# EAGLE schematic Coprocessor_Board_Rev2 (EAGLE 8.6.3)
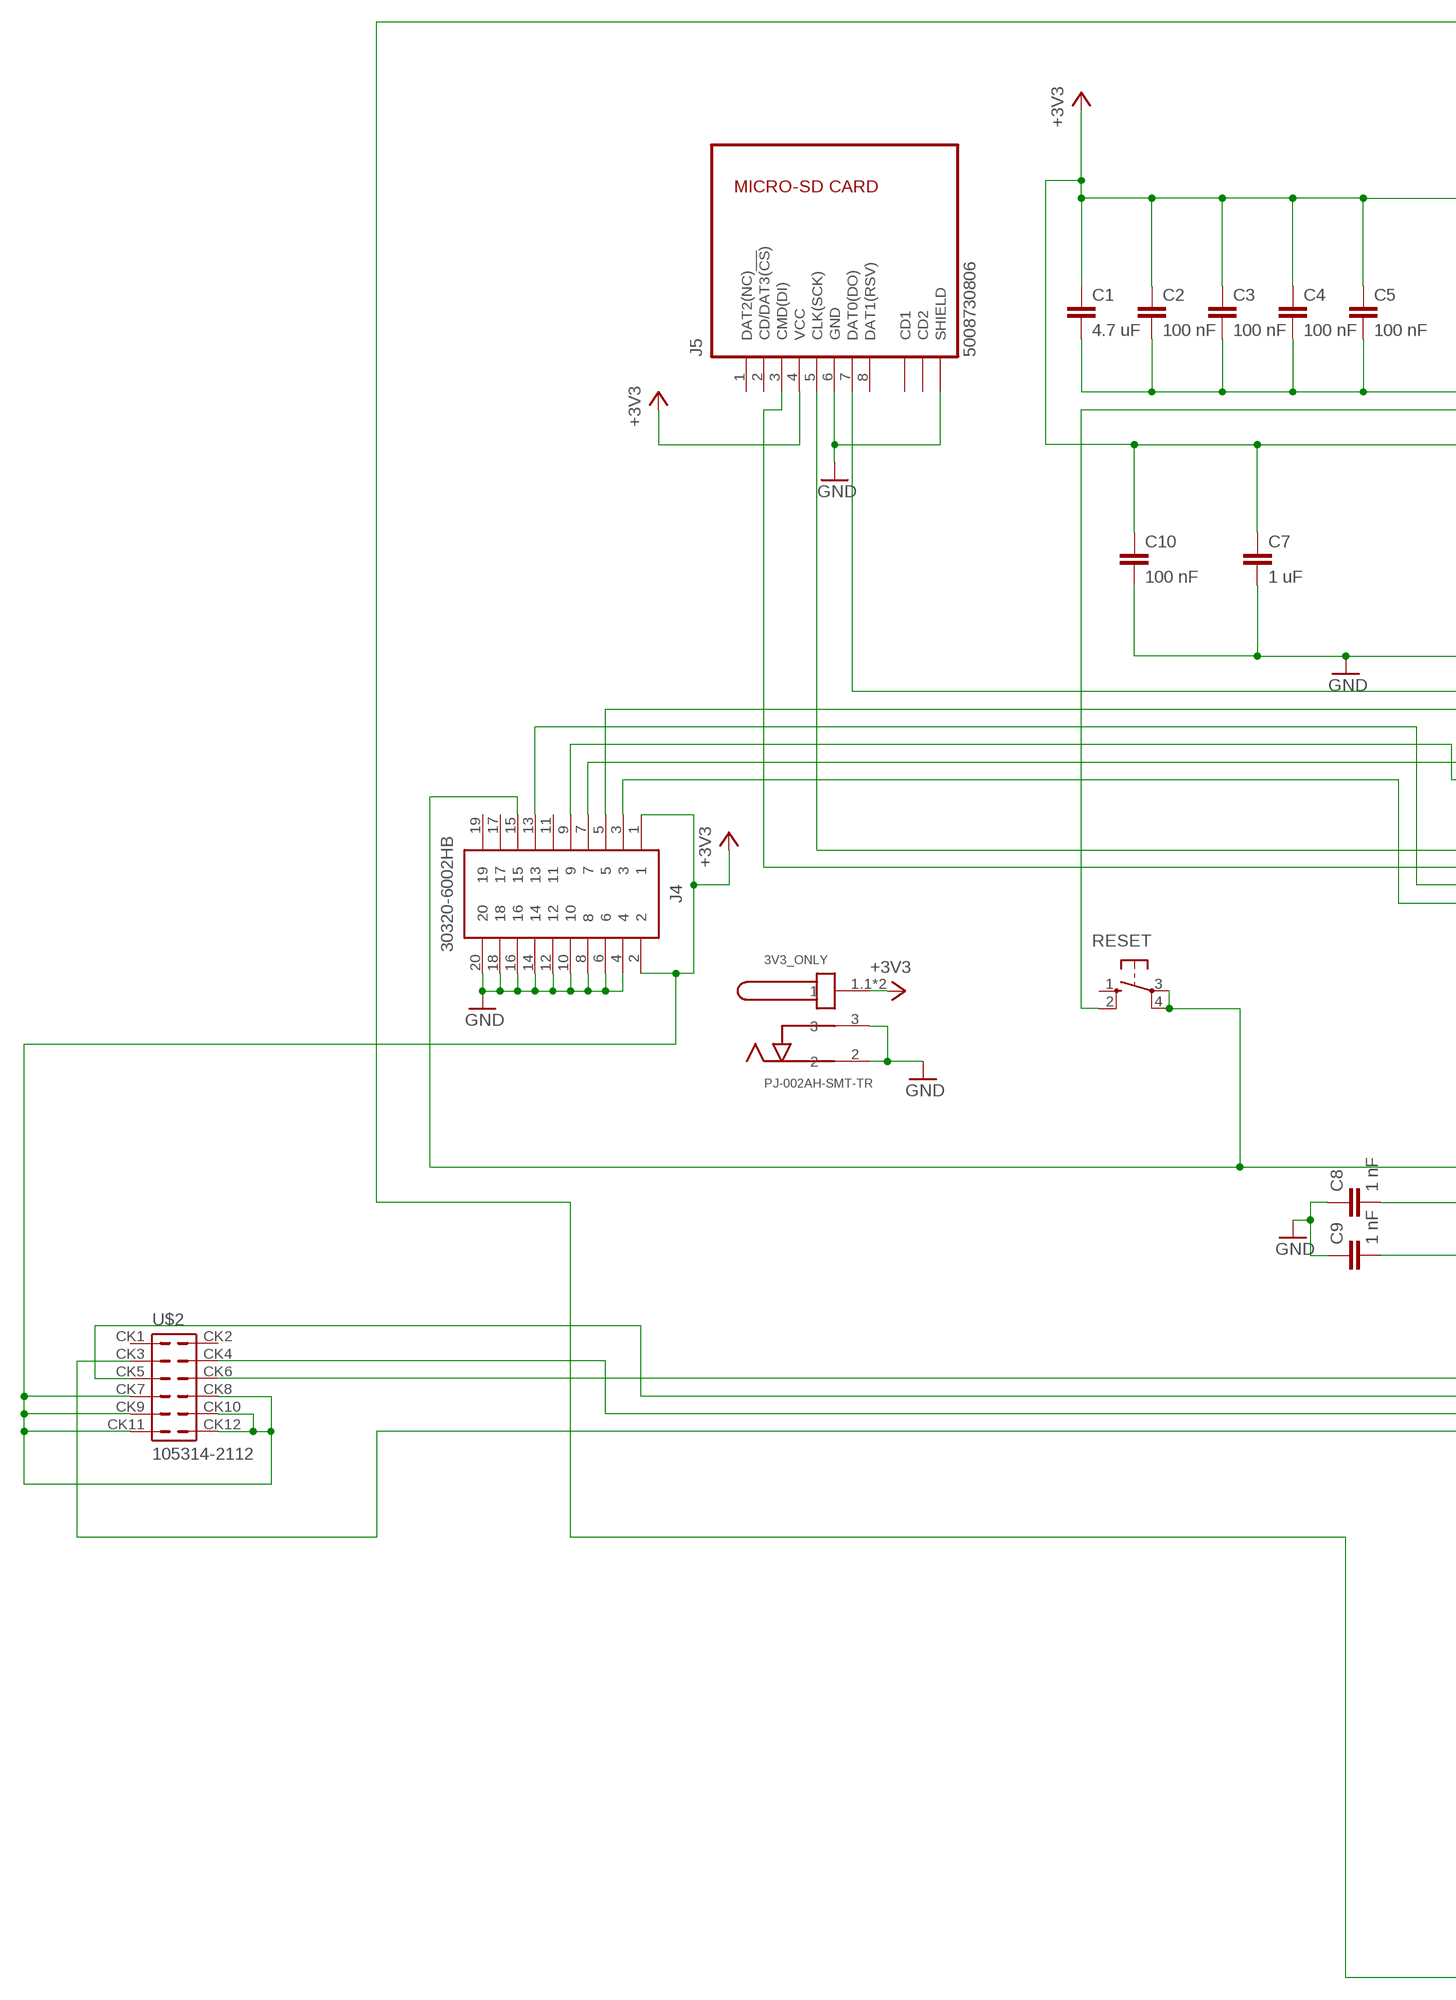
[diagram p0: schematic, sheet 1, part 1 of 2]
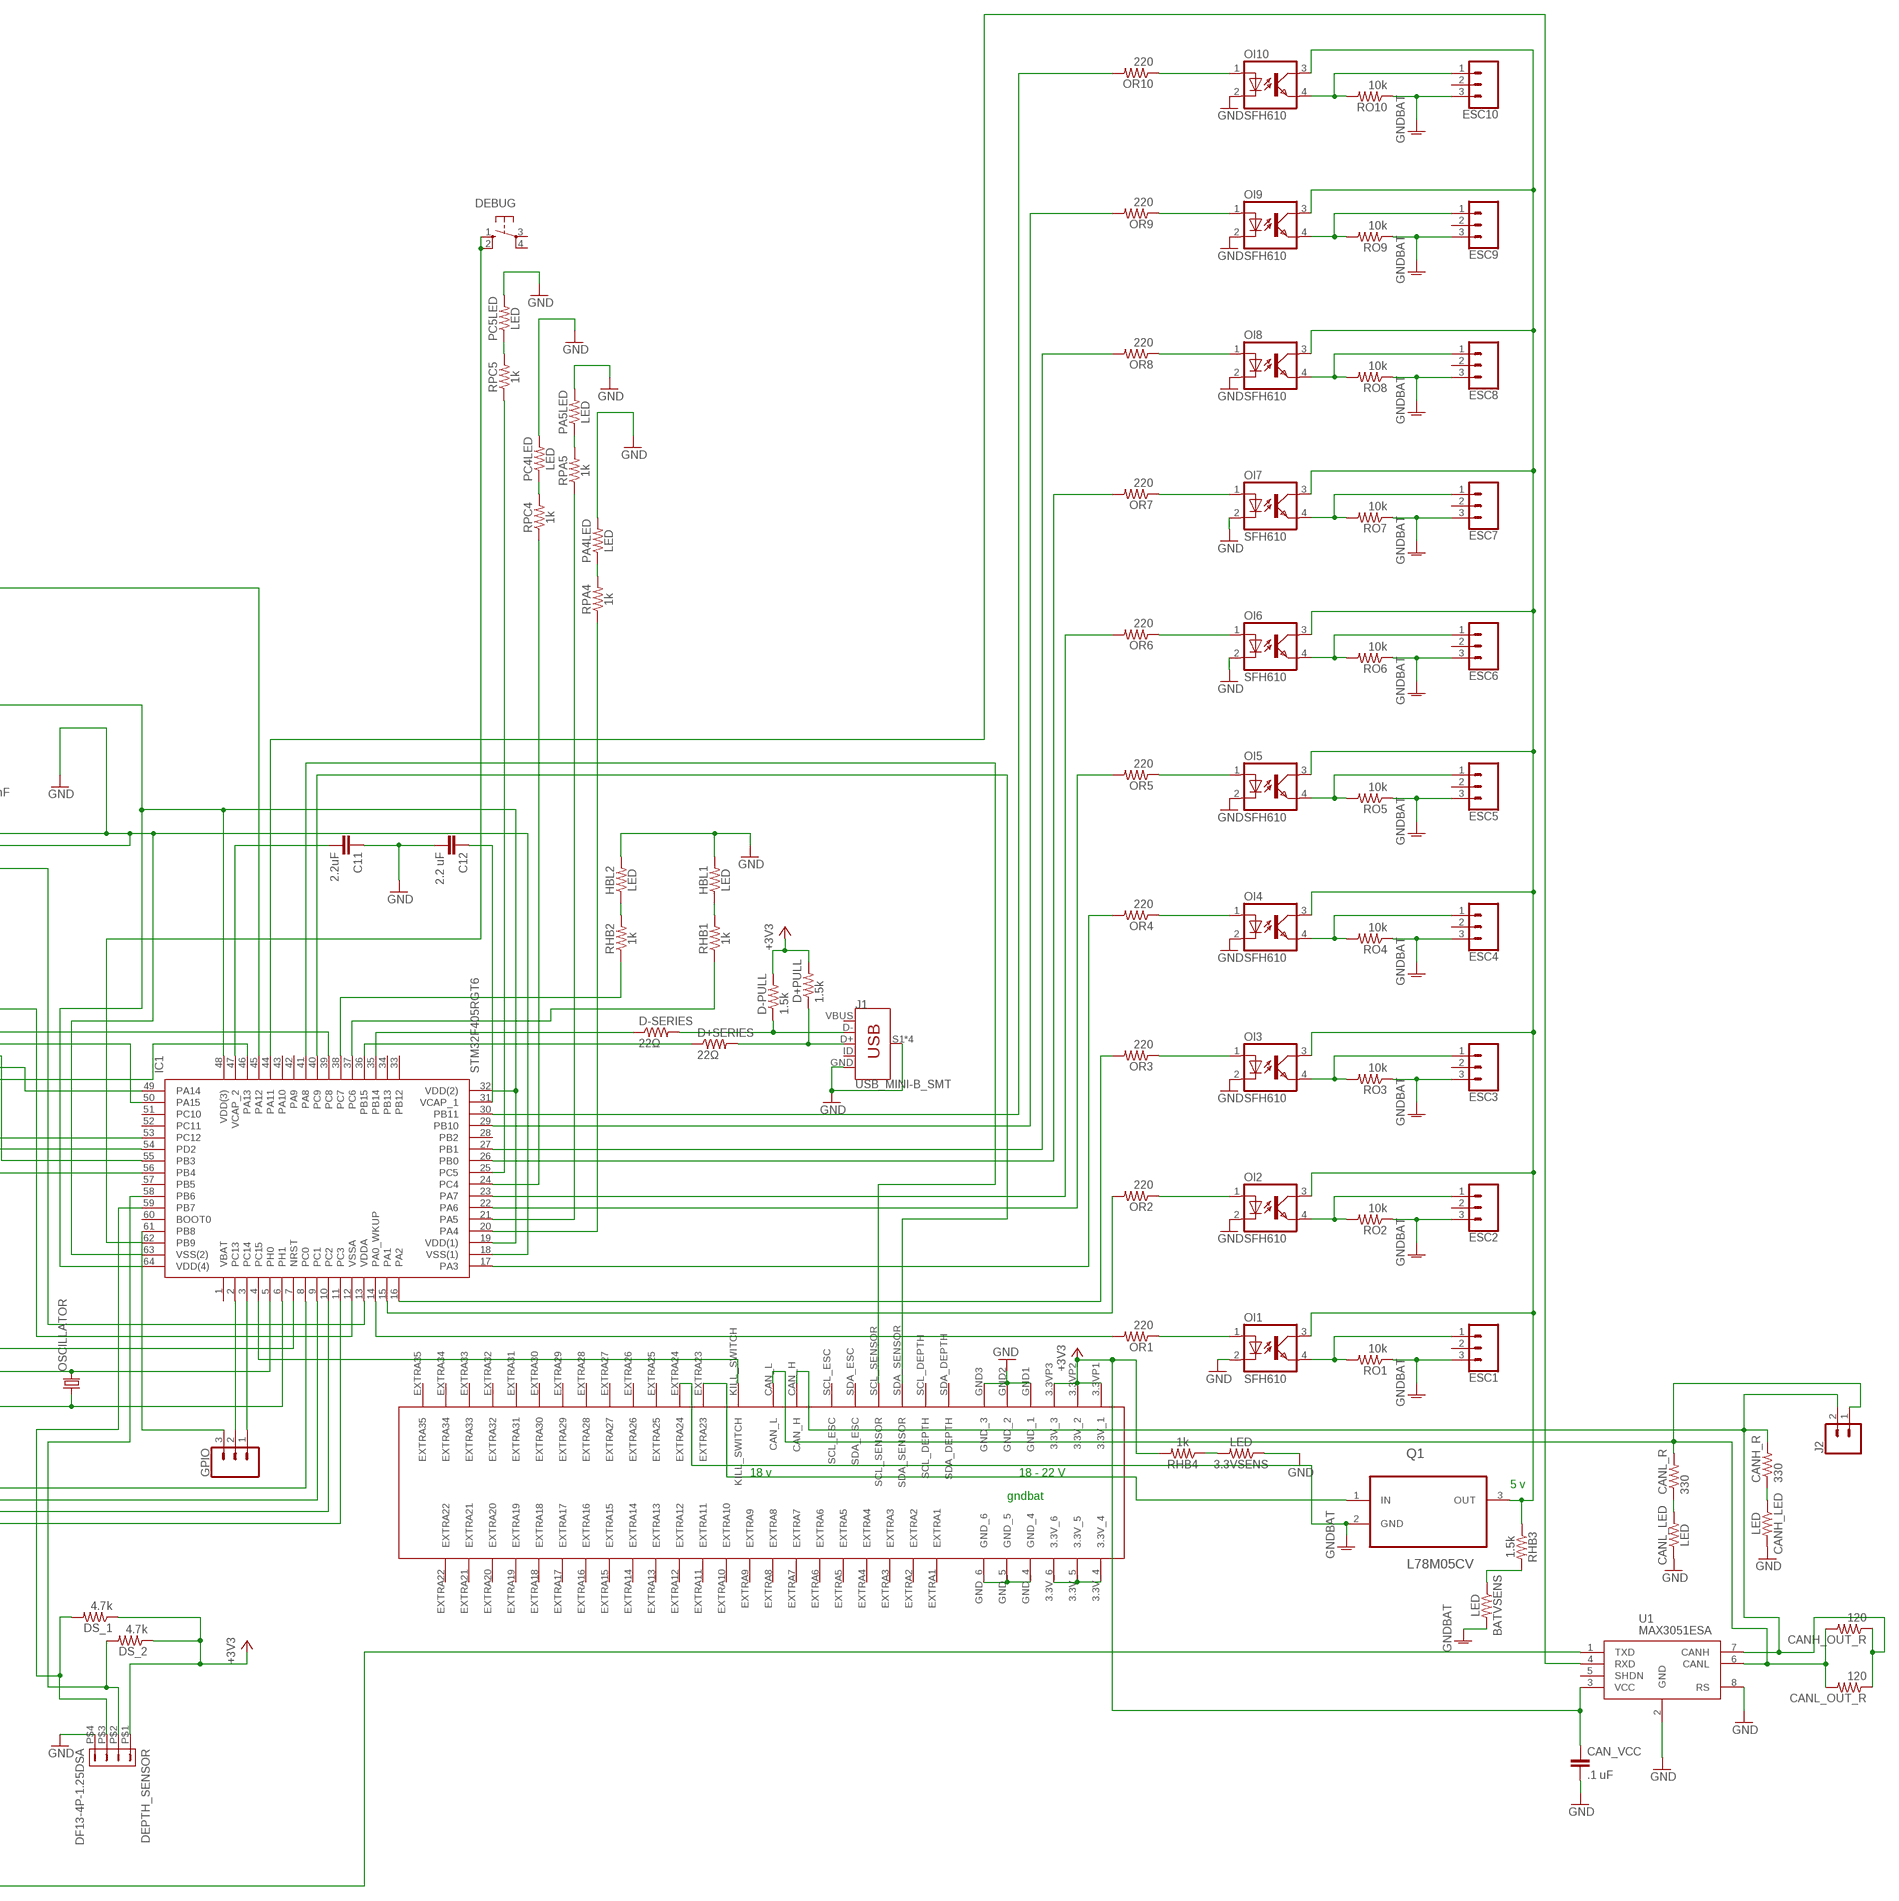
[diagram p1: schematic, sheet 1, part 2 of 2]

## Parts
3.3VSENS  LED  1KOHM-VERT-1/4W-1%  [AXIAL-0.1]
3V3_ONLY  PJ-002AH-SMT-TR  [CUI_PJ-002AH-SMT-TR]
BATVSENS  LED  1KOHM-VERT-1/4W-1%  [AXIAL-0.1]
C1  4.7 uF  0.1UF-0603-100V-10%  [0603]
C2  100 nF  0.1UF-0603-100V-10%  [0603]
C3  100 nF  0.1UF-0603-100V-10%  [0603]
C4  100 nF  0.1UF-0603-100V-10%  [0603]
C5  100 nF  0.1UF-0603-100V-10%  [0603]
C7  1 uF  0.1UF-0603-100V-10%  [0603]
C8  1 nF  22PF-PTH-2.54MM-200V-5%  [CAP-PTH-2.54]
C9  1 nF  22PF-PTH-2.54MM-200V-5%  [CAP-PTH-2.54]
C10  100 nF  0.1UF-0603-100V-10%  [0603]
C11  2.2uF  0.1UF-0603-100V-10%  [0603]
C12  2.2 uF  0.1UF-0603-100V-10%  [0603]
CAN_VCC  .1 uF  22PF-PTH-2.54MM-200V-5%  [CAP-PTH-2.54]
CANH_LED  LED  1KOHM-VERT-1/4W-1%  [AXIAL-0.1]
CANH_OUT_R  120  R-US_0204/7  [0204/7]
CANH_R  330  R-US_0204/7  [0204/7]
CANL_LED  LED  1KOHM-VERT-1/4W-1%  [AXIAL-0.1]
CANL_OUT_R  120  R-US_0204/7  [0204/7]
CANL_R  330  R-US_0204/7  [0204/7]
D+PULL  1.5k  R-US_0204/7  [0204/7]
D+SERIES  22Ω  R-US_0204/7  [0204/7]
D-PULL  1.5k  R-US_0204/7  [0204/7]
D-SERIES  22Ω  R-US_0204/7  [0204/7]
DEBUG  10-XX  [B3F-10XX]
DEPTH_SENSOR  DF13-4P-1.25DSA  [DF13-4P-1.25DSA]
DS_1  4.7k  R-US_0204/7  [0204/7]
DS_2  4.7k  R-US_0204/7  [0204/7]
ESC1  CONN_03  [1X03]
ESC2  CONN_03  [1X03]
ESC3  CONN_03  [1X03]
ESC4  CONN_03  [1X03]
ESC5  CONN_03  [1X03]
ESC6  CONN_03  [1X03]
ESC7  CONN_03  [1X03]
ESC8  CONN_03  [1X03]
ESC9  CONN_03  [1X03]
ESC10  CONN_03  [1X03]
GPIO  CONN_03  [1X03]
HBL1  LED  1KOHM-VERT-1/4W-1%  [AXIAL-0.1]
HBL2  LED  1KOHM-VERT-1/4W-1%  [AXIAL-0.1]
IC1  STM32F405RGT6  [QFP50P1200X1200X160-64N]
J1  USB_MINI-B_SMT  [USB-MINIB]
J2  CONN_02  [1X02]
J4  30320-6002HB  [SHDR20W81P254_2X10_3300X840X93]
J5  5008730806  [5008730806]
OI1  SFH610  [DIL04]
OI2  SFH610  [DIL04]
OI3  SFH610  [DIL04]
OI4  SFH610  [DIL04]
OI5  SFH610  [DIL04]
OI6  SFH610  [DIL04]
OI7  SFH610  [DIL04]
OI8  SFH610  [DIL04]
OI9  SFH610  [DIL04]
OI10  SFH610  [DIL04]
OR1  220  R-US_0204/7  [0204/7]
OR2  220  R-US_0204/7  [0204/7]
OR3  220  R-US_0204/7  [0204/7]
OR4  220  R-US_0204/7  [0204/7]
OR5  220  R-US_0204/7  [0204/7]
OR6  220  R-US_0204/7  [0204/7]
OR7  220  R-US_0204/7  [0204/7]
OR8  220  R-US_0204/7  [0204/7]
OR9  220  R-US_0204/7  [0204/7]
OR10  220  R-US_0204/7  [0204/7]
OSCILLATOR  CRYSTALHC49S  [HC49/S]
PA4LED  LED  1KOHM-VERT-1/4W-1%  [AXIAL-0.1]
PA5LED  LED  1KOHM-VERT-1/4W-1%  [AXIAL-0.1]
PC4LED  LED  1KOHM-VERT-1/4W-1%  [AXIAL-0.1]
PC5LED  LED  1KOHM-VERT-1/4W-1%  [AXIAL-0.1]
Q1  L78M05CV  [TO254P450X1020X1935-3P]
RESET  10-XX  [B3F-10XX]
RHB1  1k  1KOHM-HORIZ-1/4W-1%  [AXIAL-0.3]
RHB2  1k  1KOHM-HORIZ-1/4W-5%  [AXIAL-0.3]
RHB3  1.5k  1KOHM-HORIZ-1/4W-1%  [AXIAL-0.3]
RHB4  1k  1KOHM-HORIZ-1/4W-1%  [AXIAL-0.3]
RO1  10k  R-US_0204/7  [0204/7]
RO2  10k  R-US_0204/7  [0204/7]
RO3  10k  R-US_0204/7  [0204/7]
RO4  10k  R-US_0204/7  [0204/7]
RO5  10k  R-US_0204/7  [0204/7]
RO6  10k  R-US_0204/7  [0204/7]
RO7  10k  R-US_0204/7  [0204/7]
RO8  10k  R-US_0204/7  [0204/7]
RO9  10k  R-US_0204/7  [0204/7]
RO10  10k  R-US_0204/7  [0204/7]
RPA4  1k  1KOHM-HORIZ-1/4W-1%  [AXIAL-0.3]
RPA5  1k  1KOHM-HORIZ-1/4W-1%  [AXIAL-0.3]
RPC4  1k  1KOHM-HORIZ-1/4W-1%  [AXIAL-0.3]
RPC5  1k  1KOHM-HORIZ-1/4W-1%  [AXIAL-0.3]
U1  MAX3051ESA  [8-SOICN]
U$1  5530843  [5530843-6-BOARDFINGERS]
U$2  105314-2112  [105314-2112]

## Nets
3.3V: 3V3_ONLY.1.1 3V3_ONLY.1.2 C1.1 C2.1 C3.1 C4.1 C5.1 C7.1 C10.1 CAN_VCC.1 D+PULL.2 D-PULL.2 DEPTH_SENSOR.P$1 DS_1.1 DS_2.1 IC1.13(VDDA) IC1.19(VDD(1)) IC1.32(VDD(2)) IC1.48(VDD(3)) IC1.64(VDD(4)) J4.1 J4.2 J5.4(VCC) RHB4.P$2 U1.3(VCC) U$1.3.3V_4 U$1.3.3V_5 U$1.3.3V_6 U$1.3.3VP1(3.3V_1) U$1.3.3VP2(3.3V_2) U$1.3.3VP3(3.3V_3) U$2.CK7 U$2.CK8 U$2.CK9 U$2.CK10 U$2.CK11 U$2.CK12 ; supply symbol labelled +3V3
5V: OI1.3(COL) OI2.3(COL) OI3.3(COL) OI4.3(COL) OI5.3(COL) OI6.3(COL) OI7.3(COL) OI8.3(COL) OI9.3(COL) OI10.3(COL) Q1.3(OUT) RHB3.P$1
18V: Q1.1(IN) U$1.EXTRA23
CAN1_RXD: IC1.44(PA11) U1.4(RXD)
CAN1_TXD: IC1.45(PA12) U1.1(TXD)
CANH: CANH_OUT_R.1 CANH_R.2 CANL_OUT_R.1 J2.2 U1.7(CANH) U$1.CAN_H
CANL: CANH_OUT_R.2 CANL_OUT_R.2 CANL_R.2 J2.1 U1.6(CANL) U$1.CAN_L
D+CON: D+PULL.1 D+SERIES.2 J1.D+
D-CON: D-PULL.1 D-SERIES.2 J1.D-
DEPTHSCL: DEPTH_SENSOR.P$2 DS_2.2 IC1.58(PB6)
DEPTHSDA: DEPTH_SENSOR.P$3 DS_1.2 IC1.59(PB7)
GND: 3.3VSENS.P$1 3V3_ONLY.2 3V3_ONLY.3 C1.2 C2.2 C3.2 C4.2 C5.2 C7.2 C8.1 C9.1 C10.2 C11.1 C12.2 CAN_VCC.2 CANH_LED.P$2 CANL_LED.P$1 DEPTH_SENSOR.P$4 HBL1.P$2 HBL2.P$2 IC1.12(VSSA) IC1.18(VSS(1)) IC1.63(VSS(2)) J1.GND J1.S1(SHIELD) J1.S2(SHIELD) J1.S3(SHIELD) J1.S4(SHIELD) J4.4 J4.6 J4.8 J4.10 J4.12 J4.14 J4.16 J4.18 J4.20 J5.6(GND) J5.S3(SHIELD) J5.S4(SHIELD) OI1.2(C) OI2.2(C) OI3.2(C) OI4.2(C) OI5.2(C) OI6.2(C) OI7.2(C) OI8.2(C) OI9.2(C) OI10.2(C) PA4LED.P$2 PA5LED.P$2 PC4LED.P$2 PC5LED.P$2 RESET.2(S1) U1.2(GND) U1.8(RS) U$1.GND1(GND_1) U$1.GND2(GND_2) U$1.GND3(GND_3) U$1.GND_4 U$1.GND_5 U$1.GND_6
GNDA: BATVSENS.P$2 ; supply symbol labelled GNDBAT
GNDBAT: ESC1.3 ESC2.3 ESC3.3 ESC4.3 ESC5.3 ESC6.3 ESC7.3 ESC8.3 ESC9.3 ESC10.3 Q1.2(GND) RO1.1 RO2.1 RO3.1 RO4.1 RO5.1 RO6.1 RO7.1 RO8.1 RO9.1 RO10.1 U$1.EXTRA24
HEARTBEAT_1: IC1.37(PC6) RHB1.P$1
HEARTBEAT_2: IC1.38(PC7) RHB2.P$1
HEARTBEAT_3: IC1.20(PA4) RPA4.P$1
HEARTBEAT_4: IC1.21(PA5) RPA5.P$1
HEAVE_PORT_AFT: IC1.27(PB1) OR8.2
HEAVE_PORT_FWD: IC1.26(PB0) OR7.2
HEAVE_STBD_AFT: IC1.23(PA7) OR6.2
HEAVE_STBD_FWD: IC1.22(PA6) OR5.2
JTAG15: IC1.7(NRST) J4.15 RESET.3(P) RESET.4(P1)
KILLSWITCH: IC1.4(PC15) U$1.KILL_SWITCH
MISSION_START: IC1.8(PC0) U$2.CK6
N$1: HBL1.P$1 RHB1.P$2
N$3: BATVSENS.P$1 RHB3.P$2
N$4: 3.3VSENS.P$2 RHB4.P$1
N$5: CANH_LED.P$1 CANH_R.1
N$6: CANL_LED.P$2 CANL_R.1
N$7: PA4LED.P$1 RPA4.P$2
N$8: PA5LED.P$1 RPA5.P$2
N$10: PC4LED.P$1 RPC4.P$2
N$11: PC5LED.P$1 RPC5.P$2
N$14: HBL2.P$1 RHB2.P$2
PB8: GPIO.3 IC1.61(PB8)
PB9: DEBUG.1(S) DEBUG.2(S1) IC1.62(PB9)
PC4: IC1.24(PC4) RPC4.P$1
PC5: IC1.25(PC5) RPC5.P$1
PC13: GPIO.2 IC1.2(PC13)
PC14: GPIO.1 IC1.3(PC14)
PWM1: OI1.1(A) OR1.1
PWM2: OI2.1(A) OR2.1
PWM3: OI3.1(A) OR3.1
PWM4: OI4.1(A) OR4.1
PWM5: OI5.1(A) OR5.1
PWM5V1: ESC1.1 OI1.4(EMIT) RO1.2
PWM5V2: ESC2.1 OI2.4(EMIT) RO2.2
PWM5V3: ESC3.1 OI3.4(EMIT) RO3.2
PWM5V4: ESC4.1 OI4.4(EMIT) RO4.2
PWM5V5: ESC5.1 OI5.4(EMIT) RO5.2
PWM5V6: ESC6.1 OI6.4(EMIT) RO6.2
PWM5V7: ESC7.1 OI7.4(EMIT) RO7.2
PWM5V8: ESC8.1 OI8.4(EMIT) RO8.2
PWM5V9: ESC9.1 OI9.4(EMIT) RO9.2
PWM5V10: ESC10.1 OI10.4(EMIT) RO10.2
PWM6: OI6.1(A) OR6.1
PWM7: OI7.1(A) OR7.1
PWM8: OI8.1(A) OR8.1
PWM9: OI9.1(A) OR9.1
PWM10: OI10.1(A) OR10.1
RCC_OSC_IN: C8.2 IC1.5(PH0) OSCILLATOR.2
RCC_OSC_OUT: C9.2 IC1.6(PH1) OSCILLATOR.1
SCL_BKPLN: IC1.41(PA8) U$1.SCL_SENSOR
SDA_BKPLN: IC1.40(PC9) U$1.SDA_SENSOR
SDIO_CK: IC1.53(PC12) J5.5(CLK(SCK))
SDIO_CMD: IC1.54(PD2) J5.3(CMD(DI))
SDIO_DO: IC1.39(PC8) J5.7(DAT0(DO))
SURGEPORTHI: IC1.16(PA2) OR3.2
SURGEPORTLOW: IC1.17(PA3) OR4.2
SURGESTBDHI: IC1.14(PA0_WKUP) OR1.2
SURGESTBDLOW: IC1.15(PA1) OR2.2
SW_AFT: IC1.29(PB10) OR9.2
SW_FWD: IC1.30(PB11) OR10.2
SWITCH_3: IC1.9(PC1) U$2.CK5
SWITCH_4: IC1.10(PC2) U$2.CK4
SWITCH_5: IC1.11(PC3) U$2.CK3
SYS_JTCK-SWCLK: IC1.49(PA14) J4.9
SYS_JTDI: IC1.46(PA13) J4.7
SYS_JTDO-SWO: IC1.55(PB3) J4.13
SYS_JTMS-SWIDIO: IC1.50(PA15) J4.5
SYS_JTRST: IC1.56(PB4) J4.3
USB_OTG_HS_DM: D-SERIES.1 IC1.35(PB14)
USB_OTG_HS_DP: D+SERIES.1 IC1.36(PB15)
VCAP: C11.2 IC1.47(VCAP_2)
VCAP2: C12.1 IC1.31(VCAP_1)
Unconnected: DEBUG.3(P) DEBUG.4(P1) ESC1.2 ESC2.2 ESC3.2 ESC4.2 ESC5.2 ESC6.2 ESC7.2 ESC8.2 ESC9.2 ESC10.2 IC1.1(VBAT) IC1.28(PB2) IC1.33(PB12) IC1.34(PB13) IC1.42(PA9) IC1.43(PA10) IC1.51(PC10) IC1.52(PC11) IC1.57(PB5) IC1.60(BOOT0) J1.ID J4.11 J4.17 J4.19 J5.1(DAT2(NC)) J5.2(CD/DAT3(!CS!)) J5.8(DAT1(RSV)) J5.CD1 J5.CD2 RESET.1(S) U1.5(SHDN) U$1.EXTRA1 U$1.EXTRA2 U$1.EXTRA3 U$1.EXTRA4 U$1.EXTRA5 U$1.EXTRA6 U$1.EXTRA7 U$1.EXTRA8 U$1.EXTRA9 U$1.EXTRA10 U$1.EXTRA11 U$1.EXTRA12 U$1.EXTRA13 U$1.EXTRA14 U$1.EXTRA15 U$1.EXTRA16 U$1.EXTRA17 U$1.EXTRA18 U$1.EXTRA19 U$1.EXTRA20 U$1.EXTRA21 U$1.EXTRA22 U$1.EXTRA25 U$1.EXTRA26 U$1.EXTRA27 U$1.EXTRA28 U$1.EXTRA29 U$1.EXTRA30 U$1.EXTRA31 U$1.EXTRA32 U$1.EXTRA33 U$1.EXTRA34 U$1.EXTRA35 U$1.SCL_DEPTH U$1.SCL_ESC U$1.SDA_DEPTH U$1.SDA_ESC U$2.CK1 U$2.CK2

## Notes on the sheet
- 18 v | 18 - 22 V
- 5 v
- gndbat

## Power pins joined to a net without a drawn wire
VBUS: J1.VBUS

## Library data of the parts
3.3VSENS BATVSENS CANH_LED CANL_LED HBL1 HBL2 PA4LED PA5LED PC4LED PC5LED RHB3 = SparkFun-Resistors:1KOHM: 1kΩ resistor A resistor is a passive two-terminal electrical component that implements electrical resistance as a circuit element. Resistors act to reduce current flow, and, at the same time, act to lower voltage levels within circuits. - Wikipedia; PROD_ID: RES-12182; VALUE: 1k
3V3_ONLY = PJ-002AH-SMT-TR:PJ-002AH-SMT-TR: PJ-002 Series 2 x 6.5 mm 24 V Right Angle SMT Power Jack; AVAILABILITY: Good; DESCRIPTION: 24 VDC 5 A Surface Mount Unshielded 2 Conductors 3 Contacts Male Power Jack; MF: CUI; MP: PJ-002AH-SMT-TR; PACKAGE: None; PRICE: 0.98 USD
C1-C5 C7 C10-C12 = SparkFun-Capacitors:0.1UF: 0.1µF ceramic capacitors A capacitor is a passive two-terminal electrical component used to store electrical energy temporarily in an electric field.; PROD_ID: CAP-08390; VALUE: 0.1uF
C8 C9 CAN_VCC = SparkFun-Capacitors:22PF: 22pF ceramic capacitors A capacitor is a passive two-terminal electrical component used to store electrical energy temporarily in an electric field.; PROD_ID: CAP-09128; VALUE: 22pF
CANH_OUT_R CANH_R CANL_OUT_R CANL_R D+PULL D+SERIES D-PULL D-SERIES DS_1 DS_2 OR1-OR10 RO1-RO10 = resistor:R-US_: RESISTOR, American symbol
DEBUG RESET = switch-omron:10-XX: OMRON SWITCH; MPN: B3F-1000; OC_FARNELL: 176432; OC_NEWARK: 36M3542
DEPTH_SENSOR = con-hirose-df13:DF13-4P-1.25: DF13-4P 1.25mm Pitch Miniature Crimping Connector.
ESC1-ESC10 GPIO = SparkFun-Connectors:CONN_03: Multi connection point. Often used as Generic Header-pin footprint for 0.1 inch spaced/style header connections On any of the 0.1 inch spaced packages, you can populate with these: Break Away Headers - Straight <https://www.sparkfun.com/products/116> (PRT-00116) Break Away Male Headers - Right Angle <https://www.sparkfun.com/products/553> (PRT-00553) Female Headers <https://www.sparkfun.com/products/115> (PRT-00115) Break Away Headers - Machine Pin <https://www.sparkfun.com/products/117> (PRT-00117) Break Away Female Headers - Swiss Machine Pin <https://www.sparkfun.com/products/743> (PRT-00743) Stackable Header - 3 Pin (Female, 0.1") <https://www.sparkfun.com/products/13875> (PRT-13875) For SCREWTERMINALS and SPRING TERMINALS visit here: Screw Terimnals on SparkFun.com <https://www.sparkfun.com/search/results?term=Screw+Terminals> (5mm/3.5mm/2.54mm spacing) This device is also useful as a general connection point to wire up your design to another part of your project. Our various solder wires solder well into these plated through hole pads. Hook-Up Wire - Assortment (Stranded, 22 AWG) <https://www.sparkfun.com/products/11375> (PRT-11375) Hook-Up Wire - Assortment (Solid Core, 22 AWG) <https://www.sparkfun.com/products/11367> (PRT-11367) View the entire wire category on our website here <https://www.sparkfun.com/categories/141> Special notes: Molex polarized connector foot print use with SKU : PRT-08232 with associated crimp pins and housings.; PROD_ID: XXX-00000; VALUE: 455-1750-1-ND
IC1 = STM32F405RGT6:STM32F405RGT6: MCU 32-Bit, ARM Cortex M4, 1MB Flash STMicroelectronics STM32F405RGT6, 32bit ARM Cortex M4F Microcontroller, 168MHz, 1024 kB Flash, 64-Pin LQFP <https://componentsearchengine.com/Images/3/STM32F405RGT6.jpg> Source: Datasheet <http://www.st.com/web/en/resource/technical/document/datasheet/DM00037051.pdf>; ALLIED_NUMBER: 70391099; DESCRIPTION: MCU 32-Bit, ARM Cortex M4, 1MB Flash STMicroelectronics STM32F405RGT6, 32bit ARM Cortex M4F Microcontroller, 168MHz, 1024 kB Flash, 64-Pin LQFP; HEIGHT: 1.6mm; MANUFACTURER_NAME: STMicroelectronics; MANUFACTURER_PART_NUMBER: STM32F405RGT6; RS_PART_NUMBER: 7468217; SUPPLIER_NAME: RS
J1 = SparkFun-Connectors:USB_MINI-B: USB type Mini-B Connector Breaks out 5th pin, and includes shield pins if needed. SparkFun Products: SparkFun FTDI Basic Breakout <https://www.sparkfun.com/products/9716> SparkFun XBee Explorer USB <https://www.sparkfun.com/products/11812> SparkFun Redboard <https://www.sparkfun.com/products/12757>; PROD_ID: CONN-08193; SF_ID: PRT-00587
J2 = SparkFun-Connectors:CONN_02: Multi connection point. Often used as Generic Header-pin footprint for 0.1 inch spaced/style header connections On any of the 0.1 inch spaced packages, you can populate with these: Break Away Headers - Straight <https://www.sparkfun.com/products/116> (PRT-00116) Break Away Male Headers - Right Angle <https://www.sparkfun.com/products/553> (PRT-00553) Female Headers <https://www.sparkfun.com/products/115> (PRT-00115) Break Away Headers - Machine Pin <https://www.sparkfun.com/products/117> (PRT-00117) Break Away Female Headers - Swiss Machine Pin <https://www.sparkfun.com/products/743> (PRT-00743) For SCREWTERMINALS and SPRING TERMINALS visit here: Screw Terimnals on SparkFun.com <https://www.sparkfun.com/search/results?term=Screw+Terminals> (5mm/3.5mm/2.54mm spacing) This device is also useful as a general connection point to wire up your design to another part of your project. Our various solder wires solder well into these plated through hole pads. Hook-Up Wire - Assortment (Stranded, 22 AWG) <https://www.sparkfun.com/products/11375> (PRT-11375) Hook-Up Wire - Assortment (Solid Core, 22 AWG) <https://www.sparkfun.com/products/11367> (PRT-11367) View the entire wire category on our website here <https://www.sparkfun.com/categories/141> Special notes: Molex polarized connector foot print use with: PRT-08233 with associated crimp pins and housings. 2.54_SCREWTERM for use with PRT-10571. 3.5mm Screw Terminal footprints for PRT-08084 5mm Screw Terminal footprints for use with PRT-08432
J4 = 30320-6002HB:30320-6002HB: Header 20 position 3M 303 Series, 2.54mm Pitch 20 Way 2 Row Shrouded Straight PCB Header, Through Hole, Solder Termination <https://componentsearchengine.com/Images/3/30320-6002HB.jpg> Source: Datasheet <http://multimedia.3m.com/mws/media/22504O/3mtm-100-in-loprof-hdr-100x-100strt-ra-4-wall-ts0818.pdf>; DESCRIPTION: Header 20 position 3M 303 Series, 2.54mm Pitch 20 Way 2 Row Shrouded Straight PCB Header, Through Hole, Solder Termination; HEIGHT: 9.3mm; MANUFACTURER_NAME: 3M; MANUFACTURER_PART_NUMBER: 30320-6002HB; RS_PART_NUMBER: 8273587; SUPPLIER_NAME: RS
J5 = 5008730806:5008730806: micro SD Card Connector Molex; AVAILABILITY: Good; DESCRIPTION: Connector: for cards; SD Micro; push-push; SMT; gold plated; PIN: 8; MF: Molex; MP: 500873-0806; PACKAGE: None; PRICE: 2.47 USD
OI1-OI10 = optocoupler:SFH610: SIEMENS OPTO COUPLER; MF: VISHAY/TELEFUNKEN; MPN: SFH6106-4; OC_FARNELL: 1469568; OC_NEWARK: 58K2193
OSCILLATOR = crystal:CRYSTAL: CRYSTAL; OC_FARNELL: 1667008; OC_NEWARK: unknown
Q1 = L78M05CV:L78M05CV: Precision 500 mA regulators; AVAILABILITY: Good; DESCRIPTION: L78M05 Series 5 V 500 mA Three Terminal Positive Voltage Regulator - TO-220; MF: STMicroelectronics; MP: L78M05CV; PACKAGE: TO-220 STMicroelectronics; PRICE: 0.29 USD
RHB1 RHB4 RPA4 RPA5 RPC4 RPC5 = SparkFun-Resistors:1KOHM: 1kΩ resistor A resistor is a passive two-terminal electrical component that implements electrical resistance as a circuit element. Resistors act to reduce current flow, and, at the same time, act to lower voltage levels within circuits. - Wikipedia; PROD_ID: RES-12182
RHB2 = SparkFun-Resistors:1KOHM: 1kΩ resistor A resistor is a passive two-terminal electrical component that implements electrical resistance as a circuit element. Resistors act to reduce current flow, and, at the same time, act to lower voltage levels within circuits. - Wikipedia; PROD_ID: RES-08380
U1 = MAX3051ESA:MAX3051ESA: Can bus transciever Datasheet: http://datasheets.maximintegrated.com/en/ds/MAX3051.pdf; AVAILABILITY: Good; DESCRIPTION: IC TXRX CAN 1MBPS 8-SOIC; MF: Maxim Integrated; MP: MAX3051ESA+; PACKAGE: SOIC-8 Maxim Integrated; PRICE: 2.18 USD
U$1 = 5530843-6:5530843
U$2 = 105314-2112 nanofit hdr:105314-2112